# Altium schematic sheet Relay.SchDoc
size A4
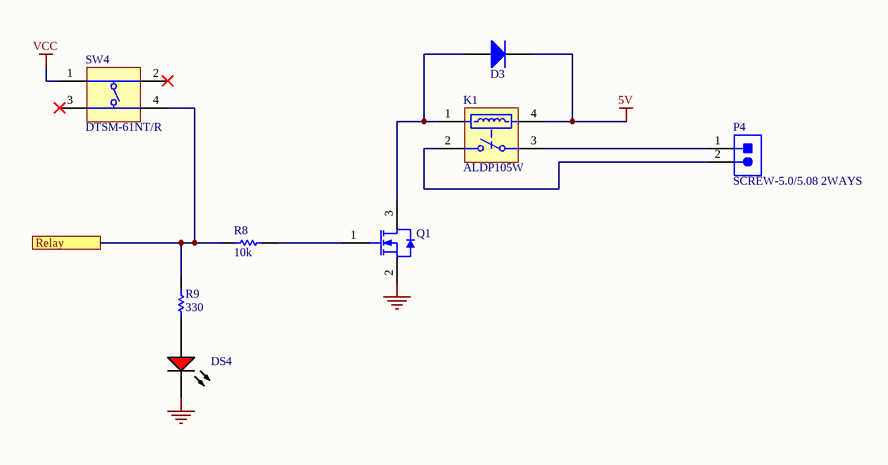
[diagram p0: Relay.SchDoc]

## Parts
D3  MMSD4148T3G  [ONSC-SOD123-2-425G-04_V]  (value not drawn)
DS4  TLMS1100-GS08  [VISH-TLMX1100_V]  (value not drawn)
K1  ALDP105W  [PNSC-LD-P-4-2050x720x1530_V]
P4  SCREW-5.0/5.08 2WAYS  [SCREW-5.0-2WAYS_V]
Q1  IRLML2502TRPBF  [INTR-SOT-23-3_V]  (value not drawn)
R8  10k  [RESC0805(2012)_L]
R9  330  [RESC0805(2012)_L]
SW4  DTSM-61NT/R  [DIPT-DTSM-6_V]

## Ports
Relay

## Nets
5V: D3.1(CATHODE) K1.4
GND: DS4.2(K) Q1.2(S)
VCC: SW4.1(T1)
Relay: R8.2 R9.1 SW4.4(T3) ; port Relay
NetD3_2: D3.2(ANODE) K1.1 Q1.3(D)
NetDS4_1: DS4.1(A) R9.2
NetK1_2: K1.2(NO) P4.2
NetK1_3: K1.3(COM) P4.1
NetQ1_1: Q1.1(G) R8.1

Not connected (* = marked no-connect by the designer): SW4 2(T2)* 3(T3)*

## Library data of the parts
D3 = CMP-0895-00002-1: Switching Diode, 100 V, 200 mA, -55 to 150 degC, 2-Pin SOD123 (425), RoHS, Tape and Reel; Manufacturer: ON Semiconductor; CD (Max): 4 pF; IR @ VR: 75 V (Max)=50 uA; PD (Max): 425 mW; VF (Max): 1 A; Trr (Max): 4 ns; VBR (Min): 100 V; ComponentLink1URL: http://www.onsemi.com/; ComponentLink1Description: Manufacturer URL; PackageReference: SOD123-2-425G-04; PackageDescription: 2-Pin SOD123, Body 2.69 x 1.6 mm, Height 1.35 mm; ComponentLink2Description: Datasheet; Mounting Technology: Surface Mount; RoHS: TRUE; PartNumber: MMSD4148T3G; PackageVersion: Rev. 04G; DatasheetVersion: Rev. 11; Temperature Range: -55 to 150 degC; ComponentLink3Description: Package Specification; Packing: Tape and Reel; ComponentLink3URL: http://www.onsemi.com/pub_link/Collateral/425-04.PDF; ComponentLink2URL: http://www.onsemi.com/pub_link/Collateral/MMSD4148T1-D.PDF
DS4 = CMP-1666-00027-1: LED, RED, 2.1 V, -40 to 100 degC, 2-Pin SMD (0603), RoHS, Tape and Reel; Type (Capacitors): C0G; Resistance: 100000000000 Ohm; Capacitance: 12 pF; Voltage Rating: 50 V; Tolerance: 5%; Min Operating Temperature: -55degC; REACH SVHC: No SVHC; ComponentLink2Description: Datasheet; ComponentLink1URL: http://www.vishay.com/; Width: 0.8 mm; Package Quantity: 4000; PackageReference: TLMX1100; ComponentLink2URL: http://www.vishay.com/docs/83173/tlmb1100.pdf; Case/Package: 0603; Case Code (Metric): 1608; Packaging: Tape and Reel; Pins: 2; ComponentLink1Description: Manufacturer URL; Max Operating Temperature: 125degC; Height: 0.8 mm; Length: 1.6 mm; Mount: Surface Mount; PackageDescription: 2-Pin Surface Mount Device, Body 1.6 x 0.8 mm; DatasheetVersion: Rev. 2.7, 03/2016; Case Code (Imperial): 0603; Voltage Rating (DC): 50 V; RoHSCompliant: True; Radiation Hardening: No
K1 = CMP-1503-00163-1: LD-P Relays, 5 V Coil Voltage, 200 mW Nominal Operating Power, -40 to 85 degC, 4-Pin LD-P, Carton, Case, RoHS; Manufacturer: Panasonic; Mechanical Life(Min.operation): 5x10^6; Max Switching Current: 5 A AC, 3 A DC; Pb-Free: True; Electrical Life: 2x10^5; Coil Voltage: 5 V; Max Switching Voltage: 277 V AC, 30 V DC; Nominal Operating Power: 200 mW; ComponentLink3Description: Package Specification; PackageVersion: ASCTB193E, 02/2014; ComponentLink1URL: http://www3.panasonic.biz/ac/ae/index.jsp; Mounting Technology: Through Hole; Packing: Carton, Case; PackageDescription: 4-Pin Through Hole Terminal Package, Body 20.5 x 7.2 mm; ComponentLink2Description: Datasheet; RoHS: True; Series: LD-P Relays; ComponentLink1Description: Manufacturer URL; ComponentLink2URL: http://www3.panasonic.biz/ac/e_download/control/relay/power/catalog/mech_eng_ldp.pdf?f_cd=300242; PartNumber: ALDP105W; DatasheetVersion: 201402-T; PackageReference: LD-P-4-2050x720x1530; ComponentLink3URL: http://www3.panasonic.biz/ac/e_download/control/relay/power/catalog/mech_eng_ldp.pdf?f_cd=300242
P4 = CMP-0617-00009-1: Socket, Screw Terminal Block, 2 Way, 5.0 mm Pitch, 90 Degree Angle, Through-Hole; Manufacturer: No Vendor; Insulation Resistance: 5000 MOhm / 1000 V; Contact Resistance: 20 mOhm; Rated Current: 25 A; Poles: 2; Rated Voltage: 300 V; PartNumber: SCREW-5.0/5.08 2WAYS; ComponentLink1Description: Datasheet; ComponentLink1URL: 5mm screw terminal in SVN; Mounting Technology: Through Hole; PackageDescription: Socket, Screw Terminal Block, 2 Way, Pitch 5 mm, 90 Degree Angle, Through-Hole; Temperature Range: -40 to 105 degC
Q1 = CMP-2000-04985-1: N-Channel HEXFET(R) Power MOSFET, 20 V VDS, +/- 12 V VGS, 4.2 A, 3-Pin SOT23, RoHS, Tape and Reel; Manufacturer: International Rectifier; Drain-to-Source Voltage [Vdss]: 20V; Drain-Source On Resistance-Max: 0.045O; Qg Gate Charge: 8nC; Rated Power Dissipation: 1.25W; Package Reference: SOT-23-3; Manufacturer URL: http://internationalrectifier.com/; Package Description: 3-Pin Small Outline Transistor, Body 2.92 x 1.3 mm, Pitch 0.95 mm; Datasheet Version: Apr-14; Channel Type: N-Channel; Datasheet URL: https://datasheet.ciiva.com/6383/irlml2502pbf-6383216.pdf
R8 R9 = CMP-1013-00624-1: 10K2 0.125W 1% 0805 (2012 Metric)  SMD; Case-Metric: 2012; Case-EIA: 0805; Value: 10200.00 Ohm; Technology: SMT; Tolerance: 1 %; Power: 0.125 W
SW4 = CMP-0306-00001-1: Switch, SPNO Push Button SMD; Manufacturer: Diptronics; Packing Type: Tape&Reel; Mechanical Life: 200,000 cycles; ComponentLink2URL: http://www.dip.com.tw/Products_tact.htm; ComponentLink1URL: http://www.dip.com.tw/; ComponentLink3URL: http://www.dip.com.tw/PDF/pro_tact/DTSM_G_-6_2_-V.pdf; PackageDescription: Switch, Through-Hole, 4 Leads, Body 8.5x8.5mm, Row Spacing 9.0mm, Pitch 4.5mm; ComponentLink2Description: Datasheet; ComponentLink3Description: Package Specification; ComponentLink1Description: Manufacturer URL; PackageReference: DTSM-6; PartNumber: DTSM-61NT/R; Mounting Technology: Through Hole